# Altium schematic sheet Relay.SchDoc
size A4
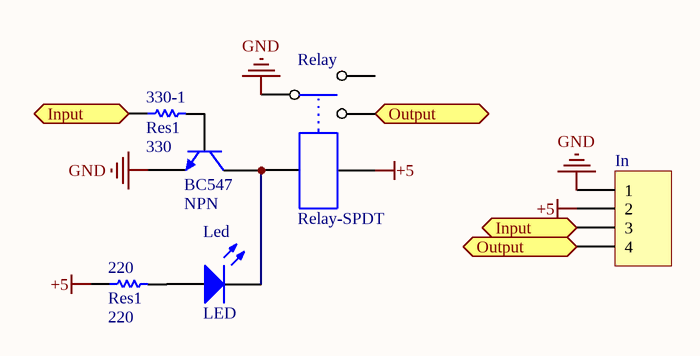
[diagram p0: Relay.SchDoc]

## Parts
220  Res1  value 220  [AXIAL-0.3]
330-1  Res1  value 330  [AXIAL-0.3]
BC547  NPN  [TO-226-AA]
In  Header 4  [My_1X04]  (value not drawn)
Led  LED  [My_LED3MM]
Relay  Relay-SPDT  [My_rel]

## Ports
Input (in), Input (out), Output (bidir)

## Nets
+5: 220.1 In.2 Relay.5
GND: BC547.3(E) In.1 Relay.1
Input: 330-1.1 In.3 ; port Input
Output: In.4 Relay.3 ; port Output
Net220_2: 220.2 Led.A
Net330-1_2: 330-1.2 BC547.2(B)
NetBC547_1: BC547.1(C) Led.K Relay.4

Not connected (* = marked no-connect by the designer): Relay 2

## Library data of the parts
220 330-1 = Res1: Resistor; Published: 8-Jun-2000; LatestRevisionDate: 17-Jul-2002; LatestRevisionNote: Re-released for DXP Platform.; PackageReference: AXIAL-0.3; Publisher: Altium Limited
  330-1: PackageDescription: Axial Device, Thru-Hole; 2 Leads; 0.3 in Pin Spacing
BC547 = NPN: NPN Bipolar Transistor; Published: 8-Jun-2000; LatestRevisionDate: 17-Jul-2002; LatestRevisionNote: Re-released for DXP Platform.; PackageReference: TO-226-AA; Publisher: Altium Limited; PackageDescription: TO, Flat Index; 3 In-Line, Axial Leads; Body Dia. 4.8mm; Leads 0.55 x 0.51 mm (max); Code_JEDEC: TO-226-AA
In = Header 4: Header, 4-Pin; LatestRevisionDate: 17-Jul-2002; LatestRevisionNote: Re-released for DXP Platform.; Publisher: Altium Limited
Led = LED: Typical INFRARED GaAs LED; Published: 8-Jun-2000; LatestRevisionDate: 08-Jul-2005; LatestRevisionNote: Mech Layer 1 removed.; Publisher: Altium Limited
Relay = Relay-SPDT: standard single contact relay